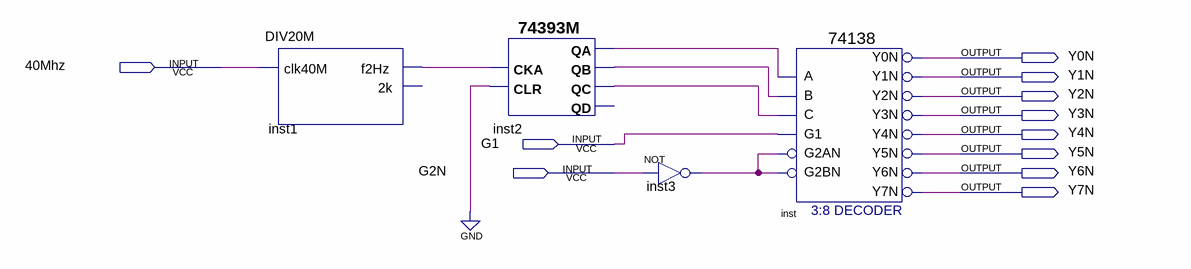
[diagram p0: schematic sheet]
// Quartus schematic decoder.bdf as structural Verilog: 4 symbols, 11 pins
module decoder (
  input  \40Mhz ,
  input  G1,
  input  G2N,
  output Y0N,
  output Y1N,
  output Y2N,
  output Y3N,
  output Y4N,
  output Y5N,
  output Y6N,
  output Y7N
);

  wire inst1_f2hz, inst2_qa, inst2_qb, inst2_qc, inst3_out;

  DIV20M inst1 (.clk40M(\40Mhz ), .f2Hz(inst1_f2hz));  // open: 2k
  \74393M  inst2 (.CLR(1'b0), .CKA(inst1_f2hz), .QC(inst2_qc), .QB(inst2_qb), .QA(inst2_qa));  // open: QD
  not inst3 (inst3_out, G2N);
  \74138  inst (
    .A(inst2_qa), .B(inst2_qb), .G1(G1), .C(inst2_qc), .G2AN(inst3_out), .G2BN(inst3_out), .Y0N(Y0N),
    .Y1N(Y1N), .Y2N(Y2N), .Y3N(Y3N), .Y4N(Y4N), .Y5N(Y5N), .Y6N(Y6N), .Y7N(Y7N));
endmodule
